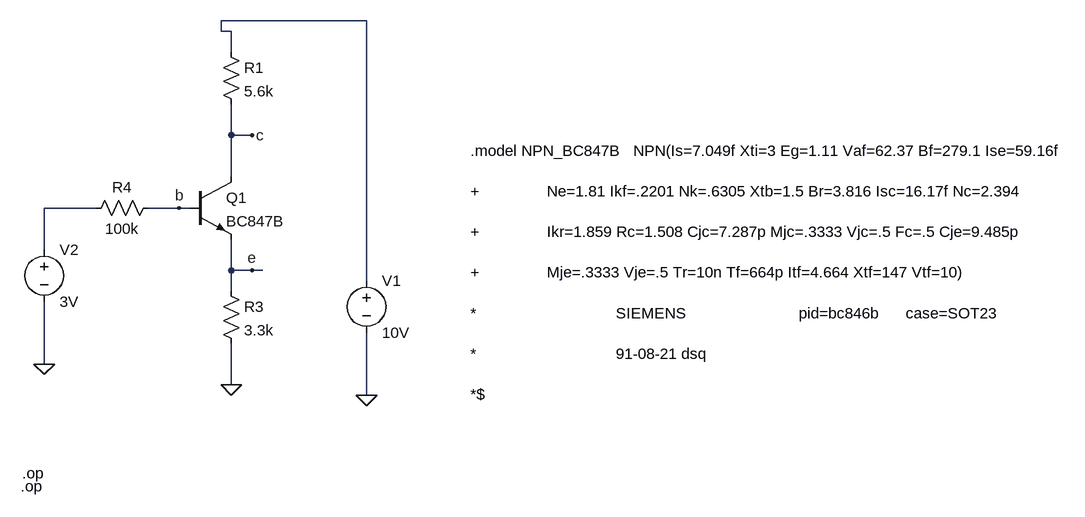
[diagram p0: schematic v1.asc]
v1.asc, the LTspice schematic file:
Version 4
SHEET 1 1496 680
WIRE 288 -144 64 -144
WIRE 64 -128 64 -144
WIRE 80 -128 64 -128
WIRE 80 -96 80 -128
WIRE 80 32 80 -16
WIRE 112 32 80 32
WIRE 80 96 80 32
WIRE -128 144 -208 144
WIRE 0 144 -48 144
WIRE 16 144 0 144
WIRE -208 208 -208 144
WIRE 80 240 80 192
WIRE 112 240 80 240
WIRE 128 240 112 240
WIRE 288 256 288 -144
WIRE 80 272 80 240
WIRE -208 384 -208 288
WIRE 80 416 80 352
WIRE 288 432 288 336
FLAG -208 384 0
FLAG 112 32 c
FLAG 112 240 e
FLAG 0 144 b
FLAG 80 416 0
FLAG 288 432 0
SYMBOL npn 16 96 R0
SYMATTR InstName Q1
SYMATTR Value BC847B
SYMBOL res 64 -112 R0
SYMATTR InstName R1
SYMATTR Value 5.6k
SYMBOL res 64 256 R0
SYMATTR InstName R3
SYMATTR Value 3.3k
SYMBOL res -32 128 R90
WINDOW 0 0 56 VBottom 2
WINDOW 3 32 56 VTop 2
SYMATTR InstName R4
SYMATTR Value 100k
SYMBOL voltage -208 192 R0
WINDOW 123 0 0 Left 2
WINDOW 39 0 0 Left 2
SYMATTR InstName V2
SYMATTR Value 3V
SYMBOL voltage 288 240 R0
WINDOW 123 0 0 Left 2
WINDOW 39 0 0 Left 2
SYMATTR InstName V1
SYMATTR Value 10V
TEXT -242 552 Left 2 !.op
TEXT 448 56 Left 2 !.model NPN_BC847B   NPN(Is=7.049f Xti=3 Eg=1.11 Vaf=62.37 Bf=279.1 Ise=59.16f\n\n+               Ne=1.81 Ikf=.2201 Nk=.6305 Xtb=1.5 Br=3.816 Isc=16.17f Nc=2.394\n\n+               Ikr=1.859 Rc=1.508 Cjc=7.287p Mjc=.3333 Vjc=.5 Fc=.5 Cje=9.485p\n\n+               Mje=.3333 Vje=.5 Tr=10n Tf=664p Itf=4.664 Xtf=147 Vtf=10)\n\n*                               SIEMENS                         pid=bc846b      case=SOT23\n\n*                               91-08-21 dsq\n\n*$
TEXT -244 572 Left 2 !.op

The netlist it stands for:
* v1.asc
Q1 c b e 0 BC847B
R1 N001 c 5.6k
R3 e 0 3.3k
R4 b N002 100k
V2 N002 0 3V
V1 N001 0 10V
.model NPN NPN
.model PNP PNP
.lib standard.bjt
.op
.model NPN_BC847B   NPN(Is=7.049f Xti=3 Eg=1.11 Vaf=62.37 Bf=279.1 Ise=59.16f
+               Ne=1.81 Ikf=.2201 Nk=.6305 Xtb=1.5 Br=3.816 Isc=16.17f Nc=2.394
+               Ikr=1.859 Rc=1.508 Cjc=7.287p Mjc=.3333 Vjc=.5 Fc=.5 Cje=9.485p
+               Mje=.3333 Vje=.5 Tr=10n Tf=664p Itf=4.664 Xtf=147 Vtf=10)
*                               SIEMENS                         pid=bc846b      case=SOT23
*                               91-08-21 dsq
*$
.op
.backanno
.end